# EAGLE design Robocups12313 (EAGLE 9.5.2)
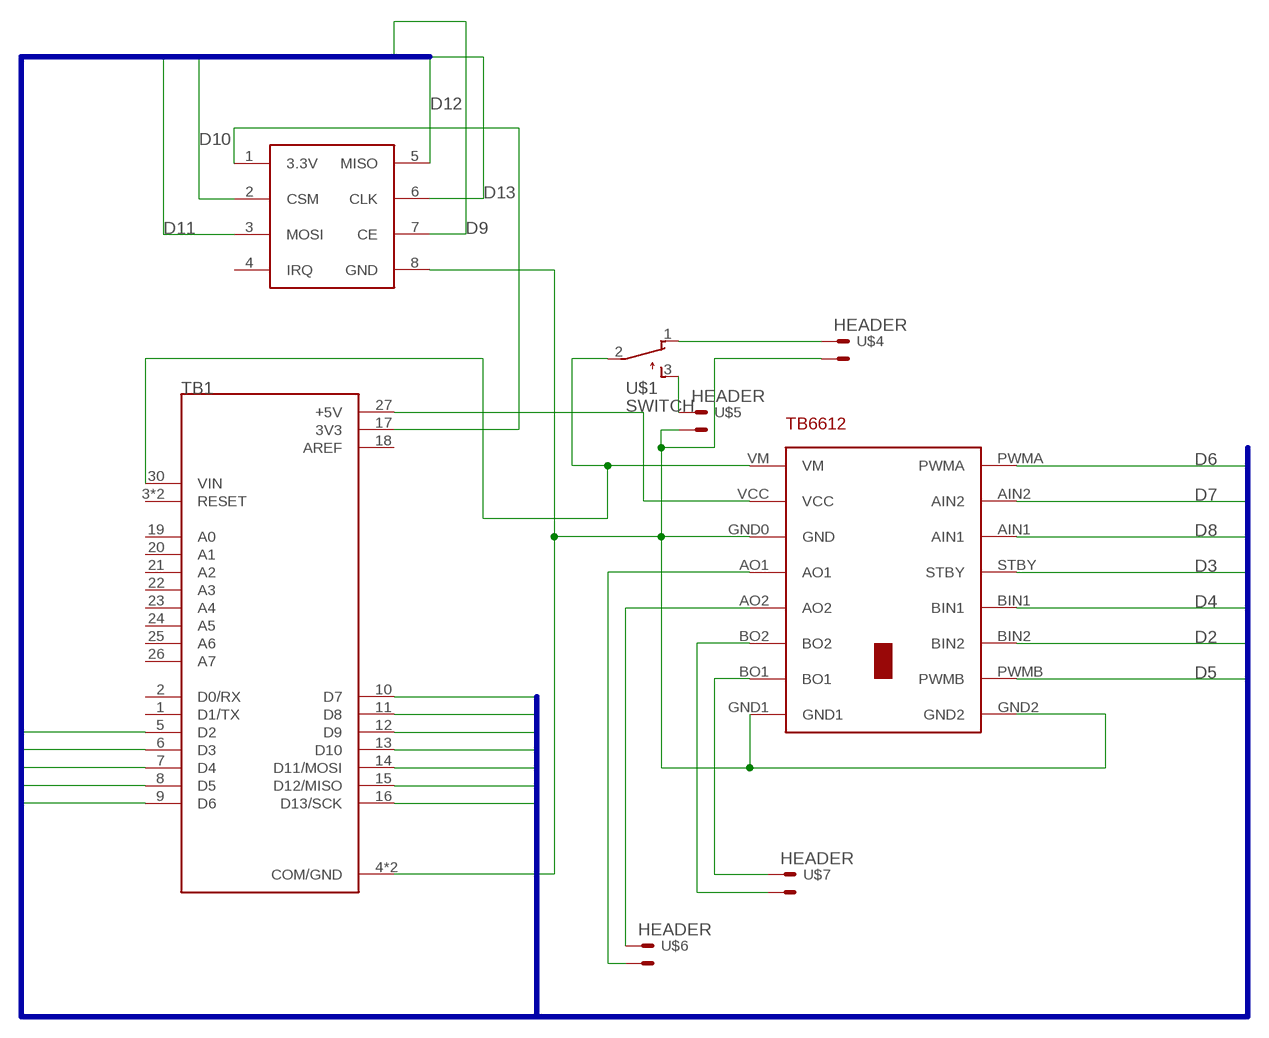
[diagram p0: schematic, sheet 1]

## Parts
TB1  ARDUINO_NANO  [SHIELD_ARDUINO_NANO]
U$1  SWITCH  [255SB]
U$2  TB6612  [TB6612FNG]
U$3  NRF  [NRF]
U$4  HEADER  [22-23-2021]
U$5  HEADER  [22-23-2021]
U$6  HEADER  [22-23-2021]
U$7  HEADER  [22-23-2021]

## Nets
D2: TB1.5(D2) U$2.BIN2
D3: TB1.6(D3) U$2.STBY
D4: TB1.7(D4) U$2.BIN1
D5: TB1.8(D5) U$2.PWMB
D6: TB1.9(D6) U$2.PWMA
D7: TB1.10(D7) U$2.AIN2
D8: TB1.11(D8) U$2.AIN1
D9: TB1.12(D9) U$3.7(CE)
D10: TB1.13(D10) U$3.2(CSM)
D11: TB1.14(D11/MOSI) U$3.3(MOSI)
D12: TB1.15(D12/MISO) U$3.5(MISO)
D13: TB1.16(D13/SCK) U$3.6(CLK)
N$1: U$2.BO1 U$7.1(S)
N$2: U$1.1(O) U$4.1(S)
N$4: U$2.AO2 U$6.1(S)
N$8: TB1.4(COM/GND) TB1.29(COM/GND) U$2.GND0(GND) U$2.GND1 U$2.GND2 U$3.8(GND) U$4.2(S1) U$5.2(S1)
N$9: U$1.3(S) U$5.1(S)
N$10: TB1.30(VIN) U$1.2(P) U$2.VM
N$11: TB1.27(+5V) U$2.VCC
N$14: TB1.17(3V3) U$3.1(3.3V)
N$18: U$2.BO2 U$7.2(S1)
N$22: U$2.AO1 U$6.2(S1)
Unconnected: TB1.1(D1/TX) TB1.2(D0/RX) TB1.3(RESET) TB1.19(A0) TB1.20(A1) TB1.21(A2) TB1.22(A3) TB1.23(A4) TB1.24(A5) TB1.25(A6) TB1.26(A7) TB1.28(RESET) U$3.4(IRQ)

## Buses
D[0..13]

## Power pins joined to a net without a drawn wire
AREF: TB1.18(AREF)

## Library data of the parts
TB1 = Robocup_Proj:ARDUINO_NANO: Arduino Nano, Through Hole; DESCRIPTION: ATmega328 Arduino Nano AVR® ATmega AVR MCU 8-Bit Embedded Evaluation Board; DIGI-KEY_PART_NUMBER: 1050-1001-ND; DIGI-KEY_PURCHASE_URL: https://www.digikey.com.tr/product-detail/en/arduino/A000005/1050-1001-ND/2638989?utm_source=snapeda&utm_medium=aggregator&utm_campaign=symbol; MF: Arduino; MP: ARDUINO NANO; PACKAGE: None
U$1 = Robocup_Proj:SWITCH
U$2 = Robocup_Proj:TB6612
U$3 = Robocup_Proj:NRF
U$4-U$7 = Robocup_Proj:HEADER

## Module NRF
Ports: 

### Library data of the parts

## Board
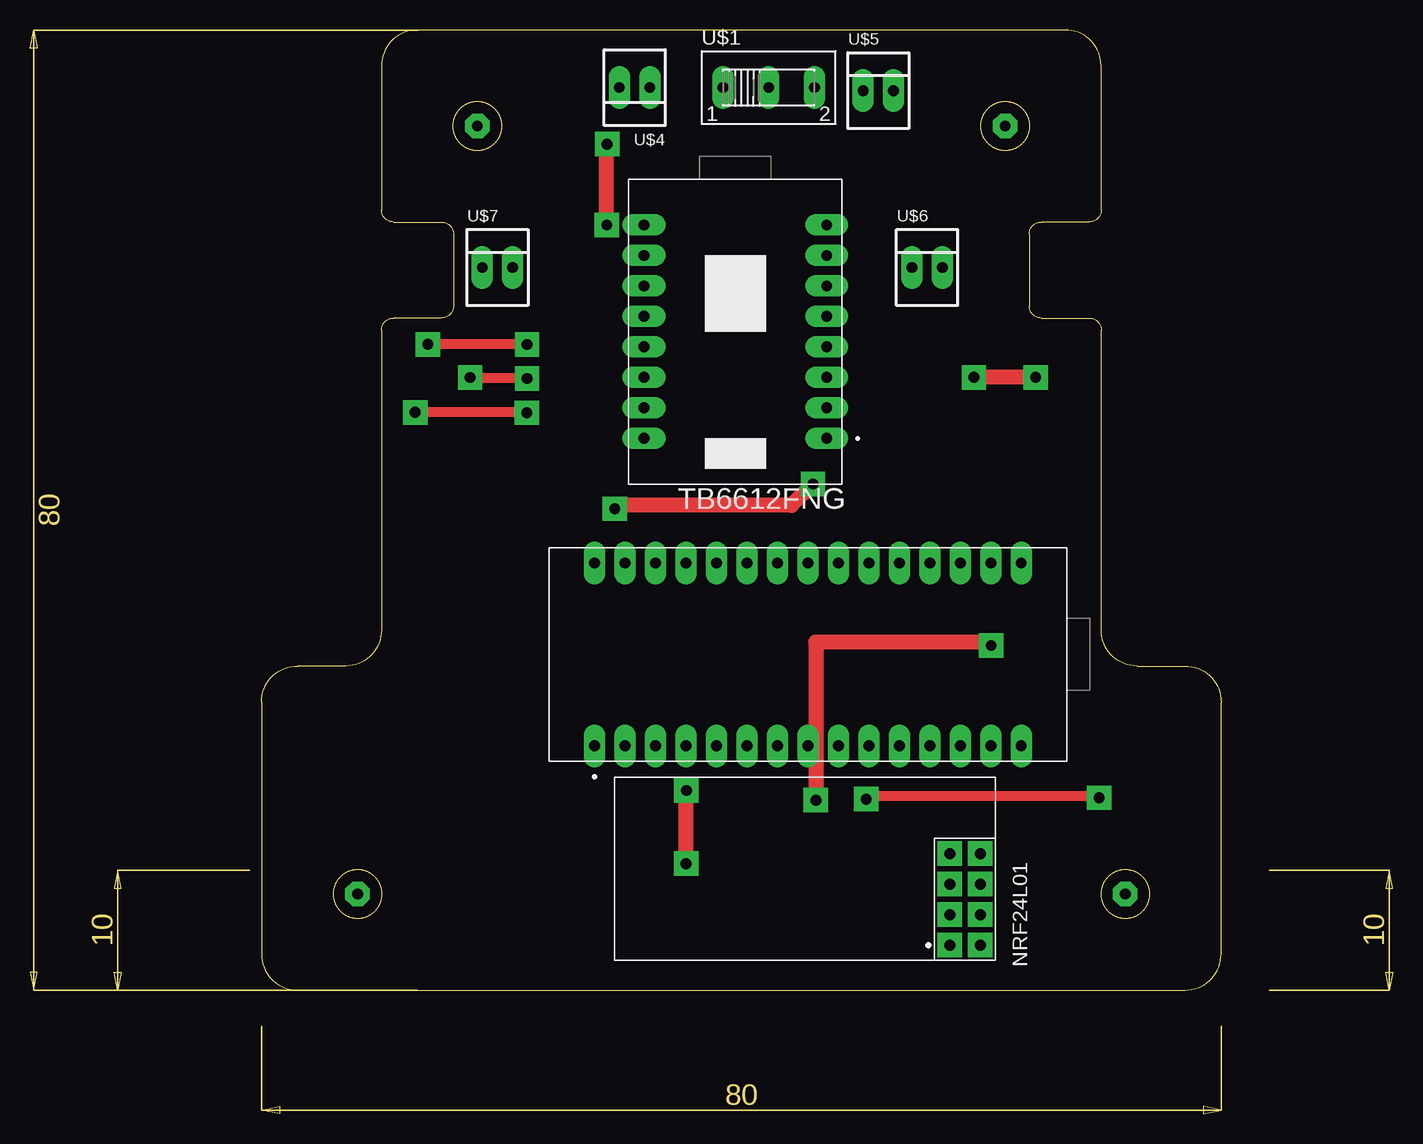
[diagram p1: board, top side]
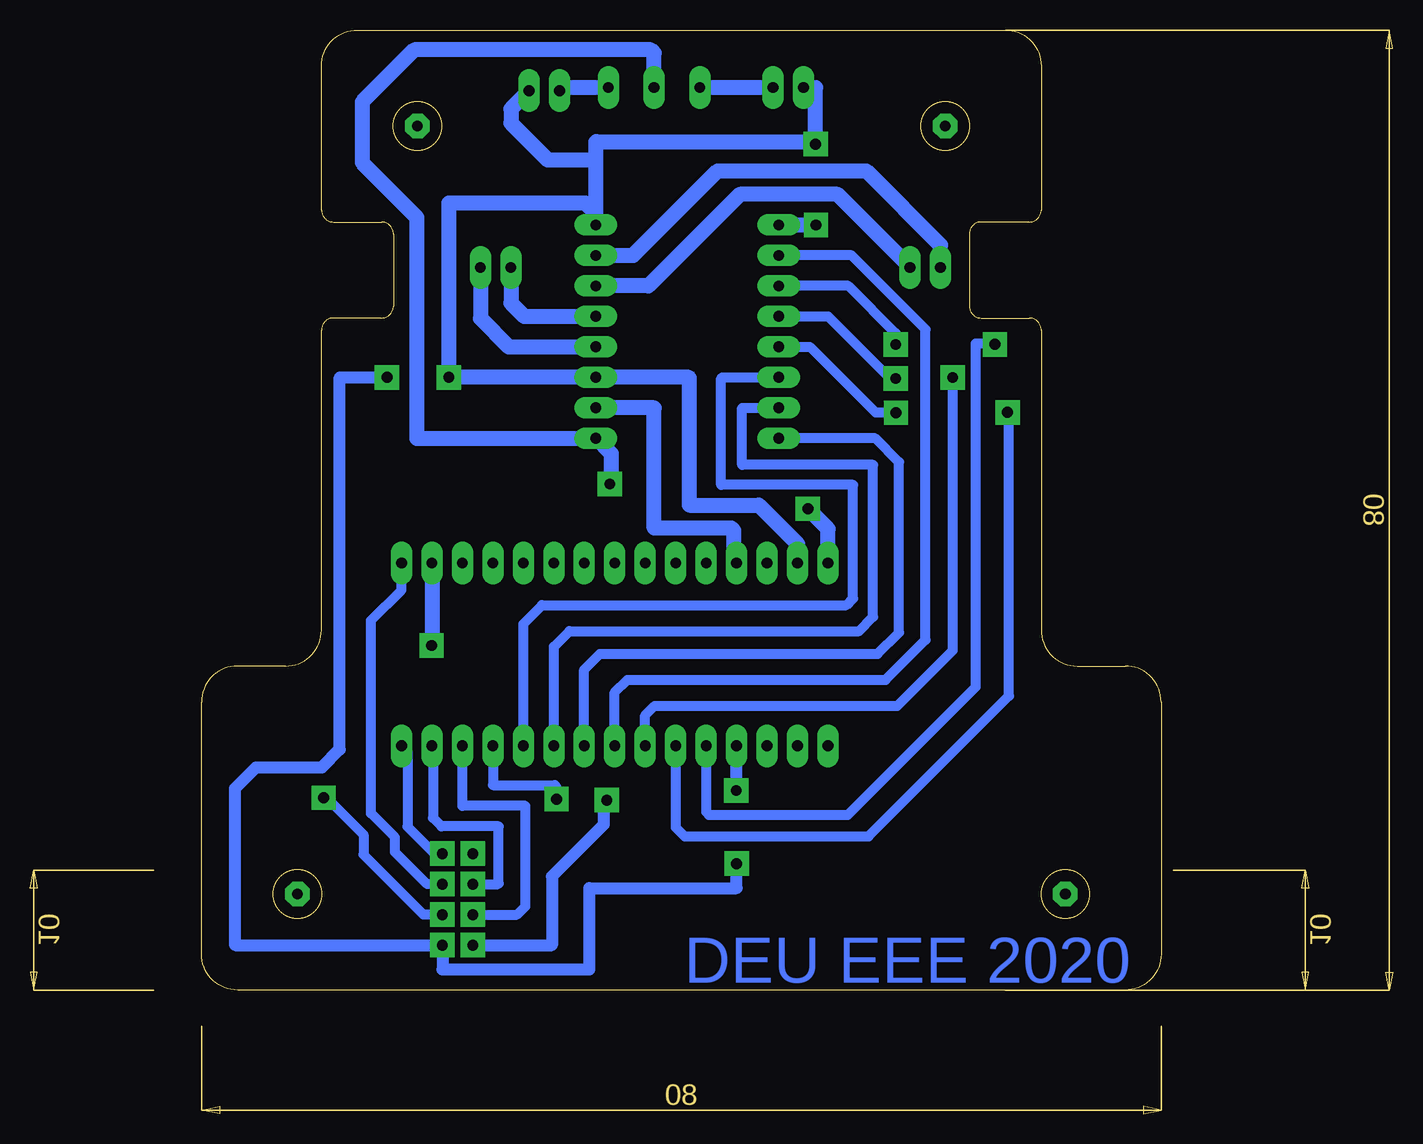
[diagram p2: board, bottom side, seen from below]

Size 80 x 80 mm. Coordinates in mm from the lower left corner, seen from the top.
Outline: 3,0 77,0 arc90 80,3 80,24 arc90 77,27 73,27 arc-90 70,30 70,55 arc90 69,56 65,56 arc-90 64,57 64,63 arc-90 65,64 69,64 arc90 70,65 70,77 arc90 67,80 13,80 arc90 10,77 10,65 arc90 11,64 15,64 arc-90 16,63 16,57 arc-90 15,56 11,56 arc90 10,55 10,30 arc-90 7,27 3,27 arc90 0,24 0,3 arc90 3,0
Outline: circle at 18,72 radius 2
Outline: circle at 62,72 radius 2
Outline: circle at 72,8 radius 2
Outline: circle at 8,8 radius 2
Copper layers (1*16): Top 0.035mm / dielectric 1.5mm / Bottom 0.035mm
Design rules "default": minimum track width 6mil, minimum drill 0.35mm, track to track 6mil, track to pad 6mil, pad to pad 6mil, via to via 6mil, smd to smd 6mil, copper to edge 40mil, drill to drill 6mil, minimum pad ring 10mil, minimum via ring 8mil, stop-mask expansion 4mil, vias tented up to drill 0mil, thermal gap 10mil

### Footprints (pad centres in the part's own frame; a part is rotated, then mirrored left to right if it is on the bottom)
SHIELD_ARDUINO_NANO = drill 0.9 pad 1.8 long: 1 -7.62,17.78; 2 -7.62,15.24; 3 -7.62,12.7; 4 -7.62,10.16; 5 -7.62,7.62; 6 -7.62,5.08; 7 -7.62,2.54; 8 -7.62,0; 9 -7.62,-2.54; 10 -7.62,-5.08; 11 -7.62,-7.62; 12 -7.62,-10.16; 13 -7.62,-12.7; 14 -7.62,-15.24; 15 -7.62,-17.78; 16 7.62,-17.78; 17 7.62,-15.24; 18 7.62,-12.7; 19 7.62,-10.16; 20 7.62,-7.62; 21 7.62,-5.08; 22 7.62,-2.54; 23 7.62,0; 24 7.62,2.54; 25 7.62,5.08; 26 7.62,7.62; 27 7.62,10.16; 28 7.62,12.7; 29 7.62,15.24; 30 7.62,17.78
255SB = drill 0.9 pad 1.803 long: 1 -3.81,0; 2 0,0; 3 3.81,0
TB6612FNG = drill 0.9 pad 1.8 long: AIN1 7.62,12.7; AIN2 7.62,15.24; AO1 -7.62,10.16; AO2 -7.62,7.62; BIN1 7.62,7.62; BIN2 7.62,5.08; BO1 -7.62,2.54; BO2 -7.62,5.08; GND0 -7.62,12.7; GND1 -7.62,0; GND2 7.62,0; PWMA 7.62,17.78; PWMB 7.62,2.54; STBY 7.62,10.16; VCC -7.62,15.24; VM -7.62,17.78
NRF = drill 0.9 pad 2.032 square: 1 0,0; 2 2.54,0; 3 5.08,0; 4 7.62,0; 5 7.62,-2.54; 6 5.08,-2.54; 7 2.54,-2.54; 8 0,-2.54
22-23-2021 = drill 0.9 pad 1.778 long: 1 -1.27,0; 2 1.27,0

### Placement (x,y rotation side)
TB1  45.55,27.96 90 top
U$1  42.28,75.2 0 top
U$2  39.51,63.75 180 top
U$3  57.38,3.74 90 top
U$4  31.1,75.2 180 top
U$5  51.42,74.95 0 top
U$6  55.48,60.21 0 top
U$7  19.67,60.21 0 top

### Tracks (layer width: path | path; a pad name or v marks a point on that pad's centre or on a via)
D2  (via drill 0.9 pad 2.03)
  Top 0.813: v22.14,53.78 22.14,53.8 v13.86,53.8
  Bottom 0.813: U$2.BIN2 26.09,58.67 22.14,54.73 v22.14,53.78 | v13.86,53.8 13.95,53.9 15.48,53.9 15.48,25.24 26.13,14.59 37.7,14.59 | TB1.5 37.93,14.84 37.69,14.59 27.13,14.59
D3  (via drill 0.9 pad 2.03)
  Top 0.813: v12.81,48.13 22.08,48.13 v22.11,48.1
  Bottom 0.813: U$2.STBY 29.28,53.59 23.82,48.13 22.14,48.13 v22.11,48.1 | TB1.6 40.47,13.55 39.74,12.81 24.39,12.81 12.69,24.51 12.69,48.01 v12.81,48.13
D4  (via drill 0.9 pad 2.03)
  Top 0.813: v22.14,50.96 17.47,50.96 v17.39,51.04
  Bottom 0.813: v22.14,50.96 22.59,50.96 27.77,56.13 U$2.BIN1 | TB1.7 43.01,22.89 42.22,23.69 21.99,23.69 17.39,28.29 v17.39,51.04
D5
  Bottom 0.813: TB1.8 45.55,24.8 44.51,25.85 22.97,25.85 19.64,29.18 19.64,55.05 25.8,61.22 U$2.PWMB
D6
  Bottom 0.813: TB1.9 48.09,26.7 46.79,28 23.64,28 21.86,29.78 21.86,44 23.84,45.98 U$2.PWMA
D7
  Bottom 0.813: TB1.10 50.63,28.61 49.33,29.91 25.19,29.91 24.02,31.08 24.02,43.75 34.94,43.75 34.94,48.52 U$2.AIN2
D8
  Bottom 0.813: TB1.11 53.17,30.51 51.62,32.07 26.24,32.07 25.68,32.63 25.68,42.1 36.69,42.1 36.69,50.96 36.59,51.05 U$2.AIN1
D9  (via drill 0.9 pad 2.03)
  Top 0.813: v69.82,16.02 69.67,16.16 50.66,16.16 v50.41,15.91
  Bottom 0.813: U$3.7 61.51,6.28 66.5,11.27 66.5,12.95 69.56,16.02 v69.82,16.02 69.83,16.02 | TB1.12 55.71,17.08 50.56,17.08 50.41,16.92 v50.41,15.91
D10
  Bottom 0.813: U$3.2 53.7,6.28 53.01,6.97 53.01,15.35 58.25,15.35 TB1.13
D11
  Bottom 0.813: U$3.3 55.28,8.82 55.23,8.88 55.23,13.64 59.99,13.64 60.7,14.35 60.7,20.25 TB1.14
D12
  Bottom 0.813: U$3.5 60.57,11.36 62.83,13.61 62.83,19.84 TB1.15
D13
  Bottom 0.813: U$3.6 61.19,8.82 63.87,11.5 63.87,12.72 65.87,14.72 65.87,30.8 63.33,33.33 TB1.16
N$1
  Bottom 1.27: U$2.BO1 44.02,61.22 36.97,68.26 24.59,68.26 18.4,62.07 U$7.1
N$2
  Bottom 1.27: U$4.1 U$1.1
N$4
  Bottom 1.27: U$2.AO2 53.11,56.13 54.21,57.24 U$6.1
N$6  (via drill 0.9 pad 2.03)
  other vias: 8,8
N$7  (via drill 0.9 pad 2.03)
  other vias: 72,8
N$8  (via drill 0.9 pad 2.03)
  Top 1.27: v28.78,63.75 28.78,70.45 v28.82,70.49 | v64.53,51.05 64.5,51.02 64.47,51.05 v59.39,51.05 | v35.39,10.53 35.39,16.6 v35.42,16.62
  Bottom 1.016: v35.39,10.53 35.39,8.49 47.68,8.49 47.68,1.72 59.92,1.72 U$3.8 77.19,3.74 77.24,3.79 77.24,16.78 75.46,18.56 69.96,18.56 68.48,20.04 68.48,51.05 v64.53,51.05 | v35.42,16.62 35.39,16.65 TB1.4
  Bottom 1.27: TB1.29 30.31,37.18 33.53,40.4 39.33,40.4 39.33,51.01 39.38,51.05 U$2.GND0 v59.39,51.05 59.39,65.6 48.01,65.6 47.12,64.71 U$2.GND1 47.12,69.08 | 28.78,70.54 28.82,70.58 v28.82,70.49 | U$2.GND2 v28.78,63.75 | 47.12,69.08 47.2,69.15 51.12,69.15 54.21,72.25 54.21,73.42 U$5.2 | v28.82,70.49 28.82,75.2 U$4.2 | v28.82,70.49 29.03,70.7 47.1,70.7 47.12,70.68 47.12,69.08
N$9
  Bottom 1.27: U$1.3 49.9,75.2 U$5.1
N$10  (via drill 0.9 pad 2.03)
  Top 1.27: v45.98,42.16 44.2,40.39 29.74,40.39 v29.46,40.11
  Bottom 1.27: v45.98,42.16 45.85,42.28 45.85,44.7 U$2.VM 62.06,45.98 62.06,64.39 66.61,68.95 66.61,74.01 62.27,78.35 42.53,78.35 42.28,78.09 U$1.2 | TB1.30 27.77,38.42 v29.46,40.11
N$11
  Bottom 1.27: TB1.27 35.39,36.73 35.63,36.97 35.63,38.29 35.82,38.48 42.28,38.48 42.28,48.52 U$2.VCC 45.85,48.52
N$12  (via drill 0.9 pad 2.03)
  other vias: 62,72
N$13  (via drill 0.9 pad 2.03)
  other vias: 18,72
N$14  (via drill 0.9 pad 2.03)
  Top 1.27: v60.82,28.7 60.52,29 46.21,29 v46.21,15.82
  Bottom 1.016: U$3.1 50.78,3.74 50.78,9.47 46.47,13.79 46.47,15.56 v46.21,15.82
  Bottom 1.27: TB1.17 60.79,28.7 v60.82,28.7 | 57.33,3.79 U$3.1
N$18
  Bottom 1.27: U$2.BO2 42.75,58.67 35.13,66.3 26.98,66.3 20.92,60.23 U$7.2
N$22
  Bottom 1.27: U$2.AO1 54.39,53.59 56.75,55.96 U$6.2

### Text on the board
Bottom: DEU EEE 2020